# Altium schematic sheet DE-220124_02.SchDoc: RS485 8 port hub
size A4; Author: eldar6776@hotmail.com; DrawnBy: Eldar Dedic; Organization: JUBERA d.o.o.; Address1: Braće Mulić 81; Address2: 71000 Sarajevo; Address3: Federacija BiH; Address4: Bosna i Hercegovina; DocumentNumber: DE-220124; Revision: 001; SheetNumber: 2; SheetTotal: 2
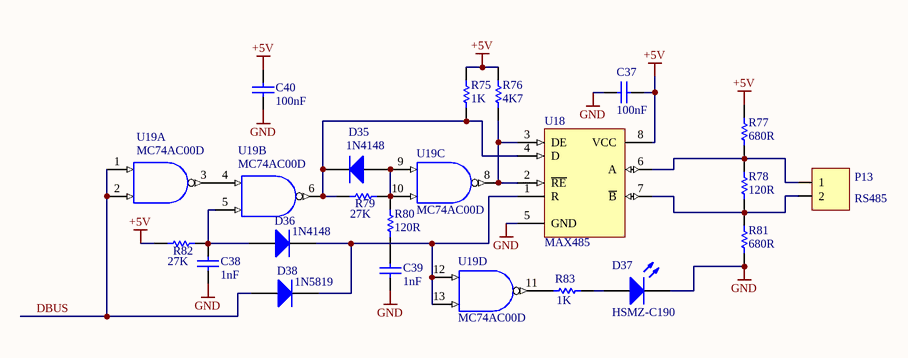
[diagram p0: DE-220124_02.SchDoc]

## Parts
C37  100nF  [0603]
C38  1nF  [0603]
C39  1nF  [0603]
C40  100nF  [0603]
D35  1N4148  [SOD323]
D36  1N4148  [SOD323]
D37  HSMZ-C190  [1.6X0.8X0.8]
D38  1N5819  [SOD323]
P13  RS485  [TERMINAL BLOK 2]
R75  1K  [ERA-0805]
R76  4K7  [ERA-0805]
R77  680R  [ERA-0805]
R78  120R  [ERA-0805]
R79  27K  [ERA-0805]
R80  120R  [ERA-0805]
R81  680R  [ERA-0805]
R82  27K  [ERA-0805]
R83  1K  [ERA-0805]
U18  MAX485  [D008_L]
U19  MC74AC00D  [751A-03_N]  (parts A,B,C,D of 4)

## Nets
+5V: C37.2 C40.2 R75.2 R76.2 R77.2 R82.2 U18.8(VCC)
GND: C37.1 C38.1 C39.1 C40.1 D37.2(K) R81.1 U18.5(GND) U19.7(GND)
VCC: U19.14(+5V)
DBUS: D38.2(A) U19.1(A) U19.2(B)
NetC38_2: C38.2 D36.2(A) R82.1 U19.5(B)
NetC39_2: C39.2 R80.2
NetD35_1: D35.1(K) R75.1 R79.2 U18.4(D) U19.6(~{Y})
NetD35_2: D35.2(A) R79.1 R80.1 U19.9(A) U19.10(B)
NetD36_1: D36.1(K) D38.1(K) U18.1(R) U19.12(A) U19.13(B)
NetD37_1: D37.1(A) R83.1
NetP13_1: P13.1 R77.1 R78.2 U18.6(A)
NetP13_2: P13.2 R78.1 R81.2 U18.7(~{B})
NetR76_1: R76.1 U18.2(~{RE}) U18.3(DE) U19.8(~{Y})
NetR83_2: R83.2 U19.11(~{Y})
NetU19_3: U19.3(~{Y}) U19.4(A)

## Notes on the sheet
- Title
- Size:
- Date:
- A4
- Number:
- Time:
- Revision:
- Sheet
- of
- File:

## Library data of the parts
C37-C40 = C0603: Ceramic Chip Capacitor - Standard; Note: Footprint corresponds to dimensions for bulk cassette packaging. This case size has tightened tolerances.; Published: 17-Jul-2002; LatestRevisionDate: 19-Mar-2004; LatestRevisionNote: Silkscreen size reduced.; DatasheetDocument: Mar-2001; PackageDocument: Mar-2001; PackageReference: 0603; Publisher: Altium Limited; Code_JEITA: 0603; Code_IPC: 1608 [0603]; ComponentLink1Description: Manufacturer Link; ComponentLink1URL: http://www.kemet.com/; ComponentLink2Description: Datasheet; ComponentLink2URL: http://www.kemet.com/kemet/web/homepage/kechome.nsf/vapubfilesname/F3102TA.pdf/$file/F3102TA.pdf
D35 D36 D38 = BAS321: General-purpose Diode; Published: 17-Sep-2003; LatestRevisionDate: 19-Mar-2004; LatestRevisionNote: Silkscreen size reduced.; DatasheetVersion: 9-Feb-1999; PackageVersion: May-1999; PackageReference: SOD323; Publisher: Altium Limited; PackageDescription: SOD-323/SC-76; 2 Leads; Body 1.7 x 1.3 mm, (LxW); ComponentLink1Description: Manufacturer Link; ComponentLink1URL: http://www.semiconductors.philips.com/; ComponentLink2Description: Datasheet; ComponentLink2URL: http://www.semiconductors.philips.com/acrobat/datasheets/BAS321_2.pdf
D37 = HSMZ-C190: High Performance Chip LED, Red; LuminousIntensity: 40mcd (Minimum).; PCB_Layout: Complies with manufacturer's recommendation.; Published: 11-Dec-2002; DatasheetVersion: 11-Mar-2002; PackageVersion: Mar-2002; PackageReference: 1.6X0.8X0.8; Publisher: Altium Limited; PackageDescription: SM LED; 2 Flat Leads; LED_Colour: Red; ComponentLink1Description: Manufacturer Link; ComponentLink1URL: http://www.avagotech.com/; ComponentLink2Description: Datasheet; ComponentLink2URL: http://cp.literature.agilent.com/litweb/pdf/5988-5891EN.pdf
P13 = TERMINAL BLOK 2: 2 pinski terminal blok
R75-R83 = ERA6Y: Rectangular Thick Film Chip Resistor, 10 Ohm to 1M Ohm Range, 0.1% and 0.5% Tolerance, 0805 Size, 0.1 W; Note: If flow soldering, adjust pad width of PCB Footprint to 0.7 - 0.8 times the width of the resistor.; Published: 17-Dec-2003; LatestRevisionDate: 19-Mar-2004; LatestRevisionNote: Silkscreen size reduced.; PackageDocument: Mar-2003; PackageReference: ERA-0805; Publisher: Altium Limited; Code_IPC: 2012 [0805]; ComponentLink1Description: Manufacturer Link; ComponentLink1URL: http://www.panasonic.com/industrial/components/resistive_products.htm; ComponentLink2Description: Datasheet; ComponentLink2URL: http://www.panasonic.com/industrial/components/pdf/AOA0000CE8.pdf
U18 = SN75176BD: Differential Bus Transceiver; Note: Receiver Hysteresis of 50mV Typical; Published: 15-May-2002; LatestRevisionDate: 13-Apr-2006; LatestRevisionNote: IPC-7351 Footprint Added.; DatasheetVersion: Sep-1989; PackageVersion: Jan-1998; PackageReference: D008; Publisher: Altium Limited; PackageDescription: 8-Pin Small Outline Integrated Circuit 1.27 mm Pitch; Code_IPC: SOIC127P600-8; ComponentLink1Description: Manufacturer Link; ComponentLink1URL: http://www.ti.com/; ComponentLink2Description: Datasheet; ComponentLink2URL: http://www-s.ti.com/sc/ds/sn75176b.pdf
U19 = MC74AC00D: Quad 2-Input NAND Gate; Published: 15-Apr-2002; LatestRevisionDate: 13-Apr-2006; LatestRevisionNote: IPC-7351 Footprint Added.; DatasheetVersion: 9-Apr-1996; PackageReference: 751A-03; Publisher: Altium Limited; PackageDescription: 14-Pin Small Outline Integrated Circuit 1.27 mm Pitch; Code_JEDEC: MS-012-AB; Code_IPC: SOIC127P600-14; ComponentLink1Description: Manufacturer Link; ComponentLink1URL: http://www.onsemi.com/; ComponentLink2Description: Datasheet; ComponentLink2URL: http://www.onsemi.com/pub/Collateral/MC74AC00-D.PDF